# EAGLE design EDm_v1.1 (EAGLE 7.6.0)
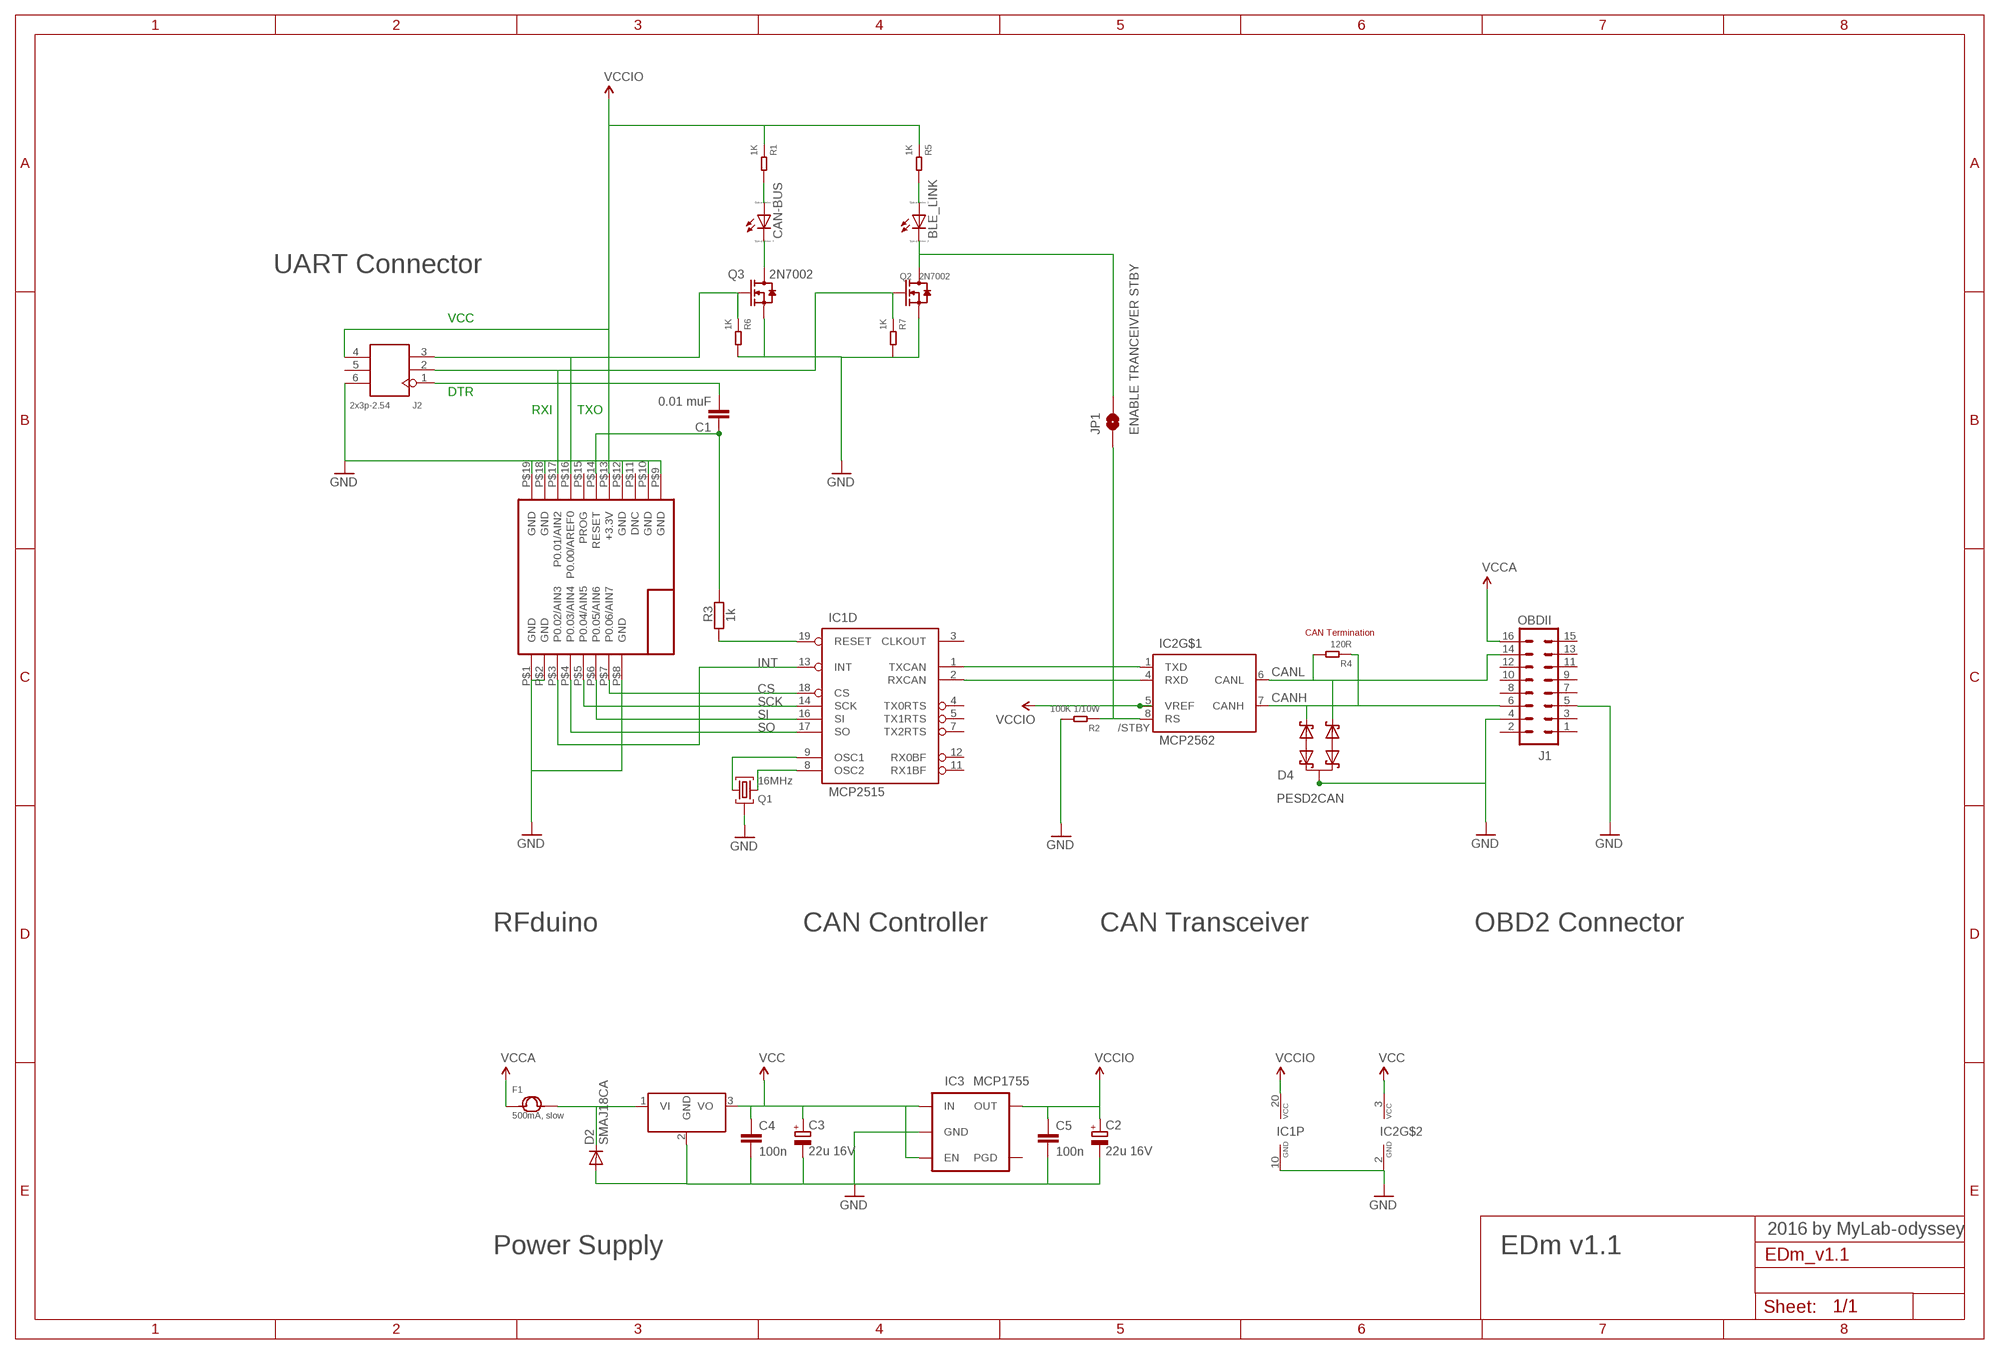
[diagram p0: schematic, sheet 1]

## Parts
78SR  DCDC_OKI-78SR  [OKI-78SRH]
BLE_LINK  LED_E  [LED_1206]
C1  0.01 muF  C-EUC0805  [C0805]
C2  22u 16V  CPOL-EUSMCA  [SMC_A]
C3  22u 16V  CPOL-EUSMCA  [SMC_A]
C4  100n  CAP0805  [0805]
C5  100n  CAP0805  [0805]
CAN-BUS  LED_E  [LED_1206]
D2  SMAJ18CA  DIODESMA  [SMA-DIODE]
D4  PESD2CAN  [SOT23]
F1  500mA, slow  FUSE500MA  [F3366]
IC1  MCP2515  MCP2515ST  [TSSOP20]
IC2  MCP2562  MCP2551SO8  [SO08]
IC3  MCP1755  [SOT23-5]
J1  OBDII  M08X2-OBDII-COMTECH  [OBDII-COMTECH]
J2  2x3p-2.54  DIP-BLACK-FEMALE-HEADER-VERT(2X3P-2.54)  [H2X3-2.54]
JP1  ENABLE TRANCEIVER STBY  JUMPER-PAD-2-NOYES_SILK  [PAD-JUMPER-2-NO_YES_SILK]
Q1  16MHz  SMD_OSC2  [SMD_OSC_35X15]
Q2  2N7002  SMD-MOSFET-N-CH-60V-300MA-LOGIC-LEVEL-FET-2N7002(SOT-23)  [SOT-23]
Q3  2N7002  SMD-MOSFET-N-CH-60V-300MA-LOGIC-LEVEL-FET-2N7002(SOT-23)  [SOT-23]
R1  1K  SMD-RES-1K-1%-1/10W(0603)  [R0603]
R2  100K 1/10W  SMD-RES-100K-5%-1/10W(0603)  [R0603]
R3  1k  R-EU_R0603  [R0603]
R4  120R  SMD-RES-120R-1%-1/10W(0603)  [R0603]
R5  1K  SMD-RES-1K-1%-1/10W(0603)  [R0603]
R6  1K  SMD-RES-1K-1%-1/10W(0603)  [R0603]
R7  1K  SMD-RES-1K-1%-1/10W(0603)  [R0603]
RFDUINO  RFD22301  [RFD21733]

## Nets
CAN_RX: IC1.2(D:RXCAN) IC2.4(RXD)
CAN_TX: IC1.1(D:TXCAN) IC2.1(TXD)
CANH: D4.1 IC2.7(CANH) J1.6 R4.1
CANL: D4.2 IC2.6(CANL) J1.14 R4.2
CS: IC1.18(D:CS) RFDUINO.P$7(P0.06/AIN7)
GND: 78SR.2(GND) C2.- C3.- C4.2 C5.2 D2.A D4.3 IC1.10(P:GND) IC2.2(GND) IC3.2(GND) J1.4 J1.5 J2.6 Q1.GND Q2.2(S) Q3.2(S) R2.2 R6.2 R7.2 RFDUINO.P$1(GND) RFDUINO.P$2(GND) RFDUINO.P$8(GND) RFDUINO.P$9(GND) RFDUINO.P$10(GND) RFDUINO.P$12(GND) RFDUINO.P$18(GND) RFDUINO.P$19(GND)
INT: IC1.13(D:INT) RFDUINO.P$3(P0.02/AIN3)
N$1: IC1.19(D:RESET) R3.2
N$2: C1.1 R3.1 RFDUINO.P$14(RESET)
N$4: J2.3 Q3.1(G) R6.1 RFDUINO.P$16(P0.00/AREF0)
N$5: J2.2 Q2.1(G) R7.1 RFDUINO.P$17(P0.01/AIN2)
N$6: C1.2 J2.1
N$8: CAN-BUS.C Q3.3(D)
N$9: CAN-BUS.A R1.2
N$10: BLE_LINK.A R5.2
N$11: BLE_LINK.C JP1.2 Q2.3(D)
N$12: IC2.8(RS) JP1.1 R2.1
N$17: 78SR.1(VI) D2.C F1.2
OSC1: IC1.9(D:OSC1) Q1.1
OSC2: IC1.8(D:OSC2) Q1.2
SCK: IC1.14(D:SCK) RFDUINO.P$5(P0.04/AIN5)
SI: IC1.16(D:SI) RFDUINO.P$6(P0.05/AIN6)
SO: IC1.17(D:SO) RFDUINO.P$4(P0.03/AIN4)
VCC: 78SR.3(VO) C3.+ C4.1 IC2.3(VCC) IC3.1(IN) IC3.3(EN)
VCCA: F1.1 J1.16
VCCIO: C2.+ C5.1 IC1.20(P:VCC) IC2.5(VREF) IC3.5(OUT) J2.4 R1.1 R5.1 RFDUINO.P$13(+3.3V)
Unconnected: IC1.3(D:CLKOUT) IC1.4(D:TX0RTS) IC1.5(D:TX1RTS) IC1.7(D:TX2RTS) IC1.11(D:RX1BF) IC1.12(D:RX0BF) IC3.4(PGD) J1.1 J1.2 J1.3 J1.7 J1.8 J1.9 J1.10 J1.11 J1.12 J1.13 J1.15 J2.5 RFDUINO.P$11(DNC) RFDUINO.P$15(PROG)

## Notes on the sheet
- UART Connector
- VCC
- DTR
- RXI | TXO
- CAN Termination
- /STBY
- RFduino | CAN Controller | CAN Transceiver | OBD2 Connector
- 2016 by MyLab-odyssey
- Power Supply | EDm v1.1

## Library data of the parts
78SR = carrilib:DCDC_OKI-78SR: 4.95W DC/DC Converter Manufacturer: Murata Part Number: OKI-78SR-5/1.5-W36H-C OKI-78SR-3.3/1.5-W36H-C
BLE_LINK CAN-BUS = eagle-ltspice:LED_E: LED Source: http://www.osram.convergy.de Source: www.luxeon.com Source: www.kingbright.com; SPICEMODEL: NONE; SPICEPREFIX: D; SPICETYPE: diode
C1 = resistor:C-EU: CAPACITOR, European symbol
C2 C3 = rcl:CPOL-EU: POLARIZED CAPACITOR, European symbol
C4 C5 = SparkFun-Capacitors:CAP: Capacitor Standard 0603 ceramic capacitor, and 0.1" leaded capacitor.
D2 = SparkFunEagle-6-6-07:DIODE: Diode These are standard reverse protection diodes and small signal diodes. SMA package can handle up to about 1A. SOD-323 can handle about 200mA. What the SOD-323 package when ordering, there are some mfgs out there that are 5-pin packages.
D4 = PESD2CAN:PESD2CAN: Silicon Schottky Diodes PESD2CAN CAN bus ESD protection diode
F1 = Seeed-OPL-fuse:FUSE
IC1 = can:MCP2515: MC2515 Stand-Alone CAN Controller With SPI Interface, Microchip
IC2 = can:MCP2551: CAN Tranceiver Microchip
IC3 = bt_regulator:MCP1755: Microchip MCP1755 LDO Voltage Regulator The MCP1755/1755S is a family of CMOS low-dropout (LDO) voltage regulators that can deliver up to 300 mA of current while consuming only 68.0 μA of quiescent current (typical). The input operating range is specified from 3.6V to 16.0V, making it an ideal choice for four to six primary cell battery-powered applications, 12V mobile applications and one to three cell Li-Ion- powered applications. datasheet.pdf <http://ww1.microchip.com/downloads/en/DeviceDoc/25160A.pdf>
J1 = MuniRent:M08X2: .1" headers, two rows of 8 each; PARTNO: OBD-II
J2 = Seeed-OPL-Connector:DIP-BLACK-FEMALE-HEADER-VERT(2X3P-2.54): 320030011; MPN: F185-1203A1BSYA1
JP1 = SparkFun-Passives:JUMPER-PAD-2-NO
Q1 = crystal:SMD_OSC
Q2 Q3 = Seeed-OPL-Transistor:SMD-MOSFET-N-CH-60V-300MA-LOGIC-LEVEL-FET-2N7002(SOT-23): 305030028; MPN: 2N7002,215
R1 R5-R7 = Seeed-OPL-Resistor:SMD-RES-1K-1%-1/10W(0603): 301010298; MPN: RC0603FR-071KL
R2 = Seeed-OPL-Resistor:SMD-RES-100K-5%-1/10W(0603): 301010089; MPN: RC0603JR-07100KL
R3 = rcl:R-EU_: RESISTOR, European symbol
R4 = Seeed-OPL-Resistor:SMD-RES-120R-1%-1/10W(0603): 301010194; MPN: RC0603FR-07120RL
RFDUINO = RFD22301-11.25.13:RFD22301: RF Digital RFD22301

## Board
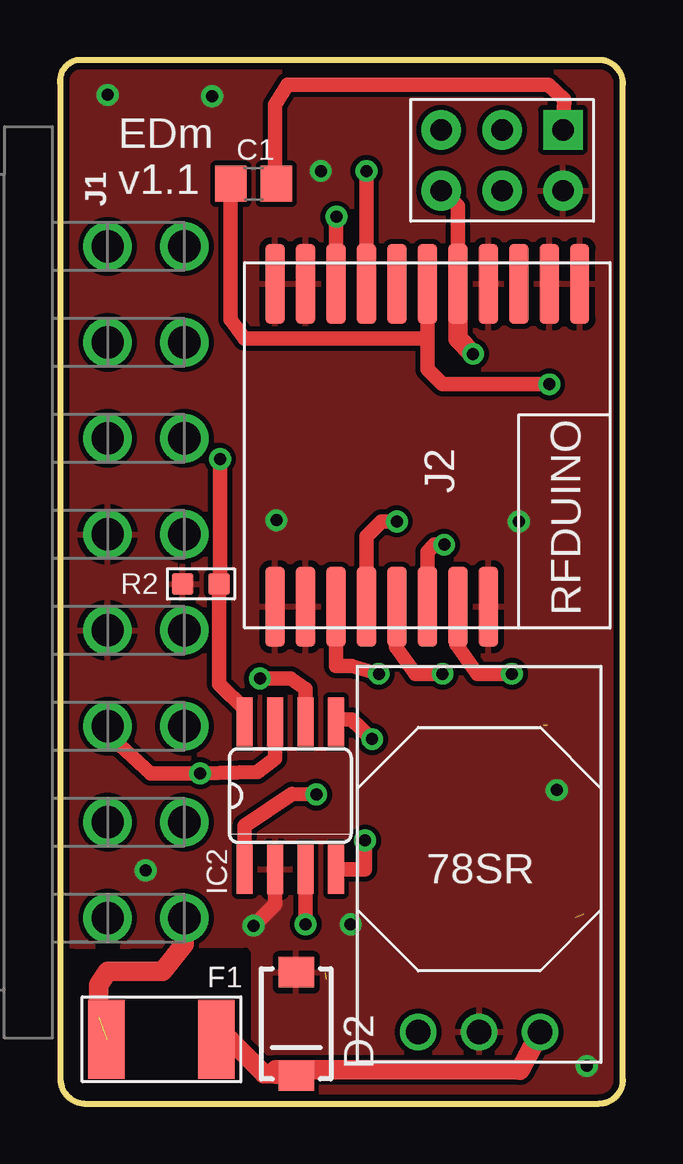
[diagram p1: board, top side]
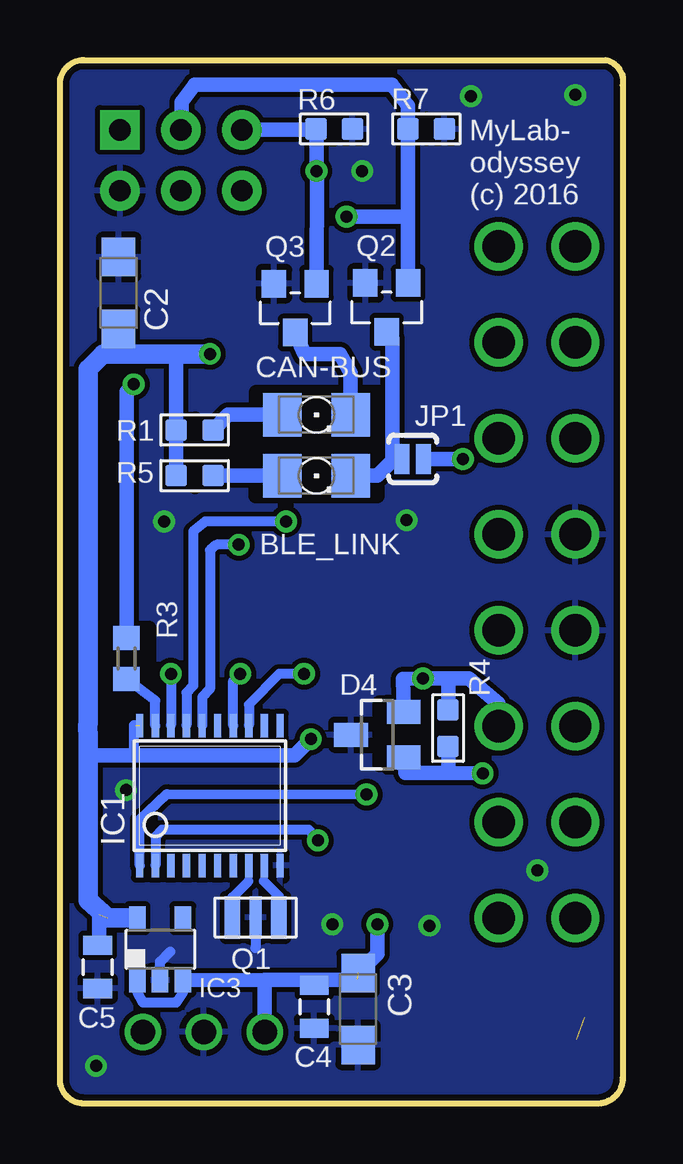
[diagram p2: board, bottom side, seen from below]

Size 23.48 x 43.5 mm. Coordinates in mm from the lower left corner, seen from the top.
Outline: 0.02,42.45 0.02,1.08 arc90 1.02,0 22.48,0 arc90 23.48,1 23.48,42.5 arc90 22.48,43.5 0.73,43.5 arc90 0.02,42.45
Copper layers (1*16): Top 0.035mm / dielectric 1.5mm / Bottom 0.035mm
Design rules "default *": minimum track width 10mil, minimum drill 24mil, track to track 8mil, track to pad 8mil, pad to pad 8mil, via to via 8mil, smd to smd 8mil, copper to edge 10mil, drill to drill 8mil, minimum pad ring 10mil, minimum via ring 8mil, stop-mask expansion 4mil, vias tented up to drill 0mil, thermal gap 10mil
tRestrict: area 0.6,0.7 to 7.7,6.3
bRestrict: area 10.2,25.3 to 15.3,29.7; area 19.8,17.9 to 21.7,19.8; area 8.3,14.1 to 10.2,16.7; 3 lines

### Footprints (pad centres in the part's own frame; a part is rotated, then mirrored left to right if it is on the bottom)
OKI-78SRH = drill 1.016: 1 2.54,0; 2 0,0; 3 -2.54,0
LED_1206 = smd 1.6 x 1.803: A -1.422,0; C 1.422,0
C0805 = smd 1.3 x 1.5: 1 -0.95,0; 2 0.95,0
SMC_A = smd 1.6 x 1.4: + -1.5,0; - 1.5,0
0805 = smd 0.8 x 1.2: 1 -0.9,0; 2 0.9,0
SMA-DIODE = smd 1.27 x 1.47: A -2.15,0; C 2.15,0
SOT23 = smd 1 x 1.4: 1 -0.95,-1.1; 2 0.95,-1.1; 3 0,1.1
F3366 = smd 1.524 x 3.302: 1 -2.286,0; 2 2.286,0
TSSOP20 = smd 0.305 x 0.991: 1 -2.925,-2.918; 2 -2.275,-2.918; 3 -1.625,-2.918; 4 -0.975,-2.918; 5 -0.325,-2.918; 6 0.325,-2.918; 7 0.975,-2.918; 8 1.625,-2.918; 9 2.275,-2.918; 10 2.925,-2.918; 11 2.925,2.918; 12 2.275,2.918; 13 1.625,2.918; 14 0.975,2.918; 15 0.325,2.918; 16 -0.325,2.918; 17 -0.975,2.918; 18 -1.625,2.918; 19 -2.275,2.918; 20 -2.925,2.918
SO08 = smd 0.66 x 2.032: 1 -1.905,-3.073; 2 -0.635,-3.073; 3 0.635,-3.073; 4 1.905,-3.073; 5 1.905,3.073; 6 0.635,3.073; 7 -0.635,3.073; 8 -1.905,3.073
SOT23-5 = smd 0.69 x 0.99: 1 -0.95,-1.3; 2 0,-1.3; 3 0.95,-1.3; 4 0.95,1.3; 5 -0.95,1.3
OBDII-COMTECH = drill 1.346: 1 -14,0; 2 -10,0; 3 -6,0; 4 -2,0; 5 2,0; 6 6,0; 7 10,0; 8 14,0; 9 -14,3.2; 10 -10,3.2; 11 -6,3.2; 12 -2,3.2; 13 2,3.2; 14 6,3.2; 15 10,3.2; 16 14,3.2
H2X3-2.54 = drill 0.889 pad 1.651 square: 1 -1.27,2.54 | drill 0.889 pad 1.651: 2 -1.27,0; 3 -1.27,-2.54; 4 1.27,-2.54; 5 1.27,0; 6 1.27,2.54
PAD-JUMPER-2-NO_YES_SILK = smd 0.635 x 1.27: 1 -0.45,0; 2 0.45,0
SMD_OSC_35X15 = smd 0.635 x 1.778: 1 -0.965,0; 2 0.965,0 | smd 0.508 x 1.778: GND 0,0
SOT-23 = smd 1.016 x 1.143: 1 -0.889,-1.016; 2 0.889,-1.016; 3 0,1.016
R0603 = smd 0.889 x 0.889: 1 0,0.762; 2 0,-0.762
R0603' = smd 1 x 1.1: 1 -0.85,0; 2 0.85,0
RFD21733 = smd 3.353 x 0.813: P$1 -6.731,6.35; P$2 -6.731,5.08; P$3 -6.731,3.81; P$4 -6.731,2.54; P$5 -6.731,1.27; P$6 -6.731,0; P$7 -6.731,-1.27; P$8 -6.731,-2.54; P$9 6.731,-6.35; P$10 6.731,-5.08; P$11 6.731,-3.81; P$12 6.731,-2.54; P$13 6.731,-1.27; P$14 6.731,0; P$15 6.731,1.27; P$16 6.731,2.54; P$17 6.731,3.81; P$18 6.731,5.08; P$19 6.731,6.35

### Placement (x,y rotation side)
78SR  17.48,2.98 0 top
BLE_LINK  12.78,26.17 0 bottom
C1  8.07,38.34 0 top
C2  21.04,33.79 90 bottom
C3  11.05,3.95 270 bottom
C4  12.88,4.03 270 bottom
C5  21.91,5.69 270 bottom
CAN-BUS  12.78,28.71 0 bottom
D2  9.85,3.32 270 top
D4  10.24,15.37 90 bottom
F1  4.23,2.68 0 top
IC1  17.23,12.83 0 bottom
IC2  9.61,12.83 0 top
IC3  19.3,6.43 0 bottom
J1  1.99,21.72 270 top
J2  18.44,39.32 270 top
JP1  8.77,26.86 180 bottom
Q1  15.32,7.75 180 bottom
Q2  9.85,33.19 180 bottom
Q3  13.67,33.16 180 bottom
R1  17.86,28.07 90 bottom
R2  5.88,21.67 270 top
R3  1k  [R0603']  20.7,18.55 270 bottom
R4  7.3,15.65 180 bottom
R5  17.86,26.17 90 bottom
R6  12.05,40.62 90 bottom
R7  8.2,40.62 90 bottom
RFDUINO  15.32,27.44 90 top

### Tracks (layer width: path | path; a pad name or v marks a point on that pad's centre or on a via)
CAN_RX  (via drill 0.5 pad 0.25)
  Top 0.61: IC2.4 12.72,9.76 v12.72,10.96
  Bottom 0.305: 19.5,9.94 IC1.2
  Bottom 0.406: v12.72,10.96 13.11,11.42 19.22,11.42 19.5,11.11 19.5,9.94
CAN_TX  (via drill 0.5 pad 0.25)
  Top 0.61: IC2.1 7.7,11.57 9.67,12.9 v10.69,12.89
  Bottom 0.406: IC1.1 20.15,11.82 19.02,12.9 v10.69,12.89
CANH  (via drill 0.5 pad 0.25)
  Top 0.61: J1.6 1.99,15.4 3.77,13.76 v5.85,13.76 8.25,13.82 8.97,14.39 IC2.7
  Bottom 0.61: D4.1 9.06,13.78 7.29,13.78 | 7.29,13.78 v5.85,13.76 | R4.1 7.27,14.85 7.29,13.78
CANL  (via drill 0.5 pad 0.25)
  Top 0.61: v8.34,17.71 9.61,17.71 10.24,17.28 IC2.6
  Bottom 0.61: J1.14 5.19,16.67 6.43,17.71 7.27,17.71 | 7.27,17.71 v8.34,17.71 9.17,17.7 D4.2 | R4.2 7.27,16.6 7.27,17.71
CS  (via drill 0.5 pad 0.25)
  Top 0.305: RFDUINO.P$7 16.54,19.14
  Top 0.61: 16.54,19.14 17.41,17.92 v18.85,17.92
  Bottom 0.305: 18.85,15.77 IC1.18
  Bottom 0.406: v18.85,17.92 18.85,15.77
GND  (via drill 0.5 pad 0.25)
  Top 0.61: 8.97,9.66 8.97,8.31 8.09,7.43
  Bottom 0.406: IC3.2 19.3,5.92 18.88,6.33 | Q1.GND 15.32,6.49
  other vias: 9.02,24.32 1.99,42.05 3.57,9.71 21.97,1.57 20.72,13.07 8.07,7.42 19.13,24.26 12.12,7.46 10.88,38.87 6.34,41.98
  pour Top: 1.35,0.14 23.17,0.14 23.17,43.22 0.33,43.22 0.33,0.27 0.72,0.27
  pour Bottom: 1.42,0.2 23.01,0.2 22.94,0.77 23.27,0.77 23.27,43.12 0.19,43.12 0.19,0.27
INT  (via drill 0.5 pad 0.25)
  Top 0.61: RFDUINO.P$3 11.51,18.25 12.15,18.25 v13.3,17.92
  Bottom 0.305: 15.6,15.77 IC1.13
  Bottom 0.406: v13.3,17.92 14.34,17.92 15.6,16.63 15.6,15.77
N$1
  Bottom 0.406: IC1.19 19.5,16.8 R3.2
N$2  (via drill 0.5 pad 0.25)
  Top 0.61: v20.4,29.98 15.96,29.98 15.32,30.61 15.32,31.89 | 15.32,31.89 RFDUINO.P$14 | C1.1 7.12,32.69 7.7,31.89 15.32,31.89
  Bottom 0.61: R3.1 20.7,29.68 v20.4,29.98
N$4  (via drill 0.5 pad 0.25)
  Top 0.61: Q3.1 v12.78,38.87
  Bottom 0.61: J2.3 12.77,40.59 | 12.77,40.59 12.78,40.14 v12.78,38.87 arc45 12.77,38.83 Q3.1 | R6.1 12.77,40.59
N$5  (via drill 0.5 pad 0.25)
  Top 0.61: RFDUINO.P$17 11.51,36.33 v11.53,36.97
  Bottom 0.61: Q2.1 8.97,36.97 | 8.97,36.97 8.96,37.83 | 8.96,37.83 R7.1 | 8.96,37.83 8.96,41.6 9.63,42.47 17.86,42.47 18.41,41.73 18.41,41.58 J2.2 | v11.53,36.97 8.97,36.97
N$6
  Top 0.406: 8.97,38.55 C1.2
  Top 0.61: J2.1 21.04,41.85 20.37,42.47 9.49,42.47 8.97,41.65 8.97,38.55
N$8
  Bottom 0.61: CAN-BUS.C 11.36,30.46 11.8,31.25 13.27,31.25 Q3.3
N$9
  Bottom 0.61: CAN-BUS.A 16.46,28.71 R1.2
N$10
  Bottom 0.61: BLE_LINK.A R5.2
N$11
  Bottom 0.61: BLE_LINK.C 10.24,26.17 9.61,26.81 | 9.61,26.81 9.61,31.89 9.82,32.1 arc45 Q2.3 | 9.22,26.81 9.22,26.82 9.27,26.82 | 9.27,26.82 9.6,26.82 9.61,26.81 | 9.27,26.82 JP1.2
N$12  (via drill 0.5 pad 0.25)
  Top 0.61: v6.68,26.86 6.68,21.7 R2.1 6.64,17.5 7.72,16.42 7.72,15.92 IC2.8
  Bottom 0.61: JP1.1 v6.68,26.86
N$17
  Top 0.813: 78SR.1 19.17,1.39 19.13,1.41 8.98,1.41 D2.C 8.51,1.23 7.07,2.68 F1.2
OSC1
  Bottom 0.305: 14.97,9.26 14.97,9.9 IC1.9
  Bottom 0.406: Q1.1 14.36,8.65 14.97,9.26
OSC2
  Bottom 0.305: 15.62,9.26 15.62,9.9 IC1.8
  Bottom 0.406: Q1.2 16.29,8.6 15.62,9.26
SCK  (via drill 0.5 pad 0.25)
  Top 0.305: 14,19.04 RFDUINO.P$5
  Top 0.61: v15.96,17.92 14.82,17.92 14,19.04
  Bottom 0.406: IC1.14 16.25,17.62 v15.96,17.92
SI  (via drill 0.5 pad 0.25)
  Top 0.61: RFDUINO.P$6 15.32,23 15.62,23.29 v16.02,23.29
  Bottom 0.305: 17.55,15.77 IC1.16
  Bottom 0.406: v16.02,23.29 16.94,23.29 17.22,23.07 17.23,17.28 17.55,16.93 17.55,15.77
SO  (via drill 0.5 pad 0.25)
  Top 0.61: RFDUINO.P$4 12.78,23.63 13.42,24.26 v14.05,24.26
  Bottom 0.305: 18.2,15.77 IC1.17
  Bottom 0.406: v14.05,24.26 17.41,24.26 17.92,23.85 17.92,17.42 18.2,17.11 18.2,15.77
VCC  (via drill 0.5 pad 0.25)  (1 unrouted)
  Top 0.61: v10.24,7.47 IC2.3
  Bottom 0.406: IC3.1 20.25,4.64 20.02,4.21 18.62,4.21 18.32,4.66 18.27,5.05 IC3.3
  Bottom 0.61: 14.94,5.16 IC3.3 | 14.94,5.16 12.78,5.16 | 12.78,5.16 10.94,5.16 11.1,5.18 | 78SR.3 14.94,5.16 | v10.24,7.47 10.24,6.25 C3.+ | C4.1 12.88,5.07 12.78,5.16
VCCA  (1 unrouted)
  Top 0.813: J1.16 5.19,6.63 4.27,5.51 2.04,5.51 1.99,5.52 1.61,4.95 1.61,3.59
VCCIO  (via drill 0.5 pad 0.25)  (2 unrouted)
  Top 0.61: IC2.5 11.51,16.01 12.15,16.01 v13.02,15.19 | J2.4 16.59,37.4 RFDUINO.P$13
  Top 0.813: v17.23,31.25 16.59,31.89 RFDUINO.P$13
  Bottom 0.305: 22.31,15.86 22.32,15.76
  Bottom 0.406: 20.32,15.76 20.4,15.76 20.4,14.5
  Bottom 0.61: 20.67,7.75 IC3.5 | 19.13,31.25 18.63,31.23 18.62,31.22 R1.1 R5.1 | v13.02,15.19 13.7,14.5 20.4,14.5 22.31,14.5 | C5.1 21.85,6.64 21.85,7.89 | C2.+ 21.04,31.25
  Bottom 0.813: 22.32,15.76 22.31,15.23 22.31,14.5 22.31,8.47 21.49,7.75 20.67,7.75 | 22.31,15.86 22.31,30.61 21.67,31.25 21.04,31.25 19.13,31.25 v17.23,31.25

### Text on the board
tNames: EDm / v1.1
bNames: MyLab- / odyssey / (c) 2016